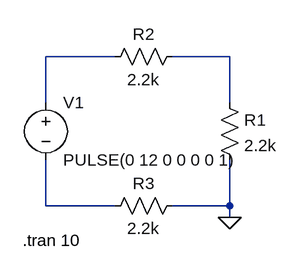
[diagram p0: schematic Q7.asc]
Q7.asc, the LTspice schematic file:
Version 4
SHEET 1 880 680
WIRE 80 48 -16 48
WIRE 240 48 160 48
WIRE -16 112 -16 48
WIRE 240 112 240 48
WIRE -16 256 -16 192
WIRE 80 256 -16 256
WIRE 240 256 240 192
WIRE 240 256 160 256
WIRE 240 272 240 256
FLAG 240 272 0
SYMBOL res 224 96 R0
SYMATTR InstName R1
SYMATTR Value 2.2k
SYMBOL res 176 32 R90
WINDOW 0 0 56 VBottom 2
WINDOW 3 32 56 VTop 2
SYMATTR InstName R2
SYMATTR Value 2.2k
SYMBOL res 176 240 R90
WINDOW 0 0 56 VBottom 2
WINDOW 3 32 56 VTop 2
SYMATTR InstName R3
SYMATTR Value 2.2k
SYMBOL voltage -16 96 R0
WINDOW 123 0 0 Left 0
WINDOW 39 0 0 Left 0
SYMATTR InstName V1
SYMATTR Value PULSE(0 12 0 0 0 0 1)
TEXT -48 304 Left 2 !.tran 10

The netlist it stands for:
* Q7.asc
R1 N002 0 2.2k
R2 N002 N001 2.2k
R3 0 N003 2.2k
V1 N001 N003 PULSE(0 12 0 0 0 0 1)
.tran 10
.backanno
.end